# EAGLE design embedded (EAGLE 9.5.2)
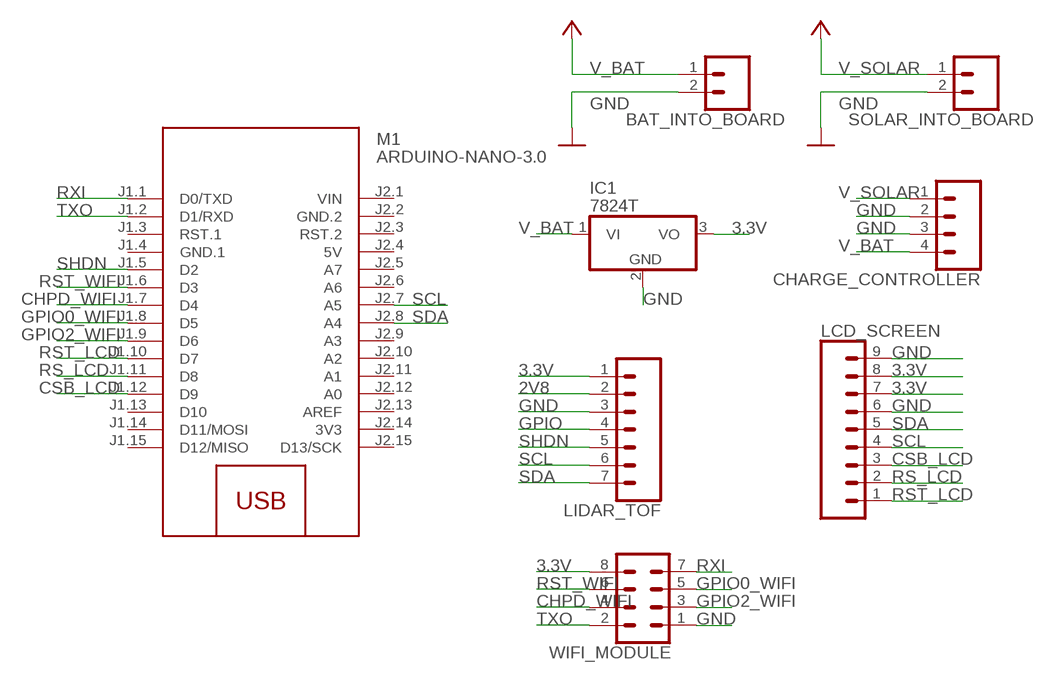
[diagram p0: schematic, sheet 1]

## Parts
BAT_INTO_BOARD  CONN_02  [1X02]
CHARGE_CONTROLLER  CONN_04  [1X04]
IC1  7824T  [TO220H]
LCD_SCREEN  CONN_09  [1X09]
LIDAR_TOF  CONN_07  [1X07]
M1  ARDUINO-NANO-3.0  [ARDUINO-NANO-3.0]
SOLAR_INTO_BOARD  CONN_02  [1X02]
WIFI_MODULE  CONN_04X2  [2X4]

## Nets
2V8: LIDAR_TOF.2
3.3V: IC1.3(VO) LCD_SCREEN.7 LCD_SCREEN.8 LIDAR_TOF.1 WIFI_MODULE.8
CHPD_WIFI: M1.J1.7(D4) WIFI_MODULE.4
CSB_LCD: LCD_SCREEN.3 M1.J1.12(D9)
GND: BAT_INTO_BOARD.2 CHARGE_CONTROLLER.2 CHARGE_CONTROLLER.3 IC1.2(GND) LCD_SCREEN.6 LCD_SCREEN.9 LIDAR_TOF.3 SOLAR_INTO_BOARD.2 WIFI_MODULE.1
GPIO: LIDAR_TOF.4
GPIO0_WIFI: M1.J1.8(D5) WIFI_MODULE.5
GPIO2_WIFI: M1.J1.9(D6) WIFI_MODULE.3
RS_LCD: LCD_SCREEN.2 M1.J1.11(D8)
RST_LCD: LCD_SCREEN.1 M1.J1.10(D7)
RST_WIFI: M1.J1.6(D3) WIFI_MODULE.6
RXI: M1.J1.1(D0/TXD) WIFI_MODULE.7
SCL: LCD_SCREEN.4 LIDAR_TOF.6 M1.J2.7(A5)
SDA: LCD_SCREEN.5 LIDAR_TOF.7 M1.J2.8(A4)
SHDN: LIDAR_TOF.5 M1.J1.5(D2)
TXO: M1.J1.2(D1/RXD) WIFI_MODULE.2
V_BAT: BAT_INTO_BOARD.1 CHARGE_CONTROLLER.4 IC1.1(VI) ; supply symbol labelled VCC
V_SOLAR: CHARGE_CONTROLLER.1 SOLAR_INTO_BOARD.1 ; supply symbol labelled VCC
Unconnected: M1.J1.3(RST.1) M1.J1.13(D10) M1.J1.14(D11/MOSI) M1.J1.15(D12/MISO) M1.J2.3(RST.2) M1.J2.5(A7) M1.J2.6(A6) M1.J2.9(A3) M1.J2.10(A2) M1.J2.11(A1) M1.J2.12(A0) M1.J2.13(AREF) M1.J2.15(D13/SCK)

## Power pins joined to a net without a drawn wire
3V3: M1.J2.14(3V3)
5V: M1.J2.4(5V)
GND.1: M1.J1.4(GND.1)
GND.2: M1.J2.2(GND.2)
VIN: M1.J2.1(VIN)

## Library data of the parts
BAT_INTO_BOARD SOLAR_INTO_BOARD = SparkFun-Connectors:CONN_02: Multi connection point. Often used as Generic Header-pin footprint for 0.1 inch spaced/style header connections On any of the 0.1 inch spaced packages, you can populate with these: Break Away Headers - Straight <https://www.sparkfun.com/products/116> (PRT-00116) Break Away Male Headers - Right Angle <https://www.sparkfun.com/products/553> (PRT-00553) Female Headers <https://www.sparkfun.com/products/115> (PRT-00115) Break Away Headers - Machine Pin <https://www.sparkfun.com/products/117> (PRT-00117) Break Away Female Headers - Swiss Machine Pin <https://www.sparkfun.com/products/743> (PRT-00743) For SCREWTERMINALS and SPRING TERMINALS visit here: Screw Terimnals on SparkFun.com <https://www.sparkfun.com/search/results?term=Screw+Terminals> (5mm/3.5mm/2.54mm spacing) This device is also useful as a general connection point to wire up your design to another part of your project. Our various solder wires solder well into these plated through hole pads. Hook-Up Wire - Assortment (Stranded, 22 AWG) <https://www.sparkfun.com/products/11375> (PRT-11375) Hook-Up Wire - Assortment (Solid Core, 22 AWG) <https://www.sparkfun.com/products/11367> (PRT-11367) View the entire wire category on our website here <https://www.sparkfun.com/categories/141> Special notes: Molex polarized connector foot print use with: PRT-08233 with associated crimp pins and housings. 2.54_SCREWTERM for use with PRT-10571. 3.5mm Screw Terminal footprints for PRT-08084 5mm Screw Terminal footprints for use with PRT-08432
CHARGE_CONTROLLER = SparkFun-Connectors:CONN_04: Multi connection point. Often used as Generic Header-pin footprint for 0.1 inch spaced/style header connections On any of the 0.1 inch spaced packages, you can populate with these: Break Away Headers - Straight <https://www.sparkfun.com/products/116> (PRT-00116) Break Away Male Headers - Right Angle <https://www.sparkfun.com/products/553> (PRT-00553) Female Headers <https://www.sparkfun.com/products/115> (PRT-00115) Break Away Headers - Machine Pin <https://www.sparkfun.com/products/117> (PRT-00117) Break Away Female Headers - Swiss Machine Pin <https://www.sparkfun.com/products/743> (PRT-00743) For SCREWTERMINALS and SPRING TERMINALS visit here: Screw Terimnals on SparkFun.com <https://www.sparkfun.com/search/results?term=Screw+Terminals> (5mm/3.5mm/2.54mm spacing) This device is also useful as a general connection point to wire up your design to another part of your project. Our various solder wires solder well into these plated through hole pads. Hook-Up Wire - Assortment (Stranded, 22 AWG) <https://www.sparkfun.com/products/11375> (PRT-11375) Hook-Up Wire - Assortment (Solid Core, 22 AWG) <https://www.sparkfun.com/products/11367> (PRT-11367) View the entire wire category on our website here <https://www.sparkfun.com/categories/141> Special notes: Molex polarized connector foot print use with SKU : PRT-08231 with associated crimp pins and housings. 1MM SMD Version SKU: PRT-10208; PROD_ID: CONN-09696
IC1 = adafruit:78*: Positive VOLTAGE REGULATOR Added bigger pads to the TO-92 package
LCD_SCREEN = SparkFun-Connectors:CONN_09: Multi connection point. Often used as Generic Header-pin footprint for 0.1 inch spaced/style header connections On any of the 0.1 inch spaced packages, you can populate with these: Break Away Headers - Straight <https://www.sparkfun.com/products/116> (PRT-00116) Break Away Male Headers - Right Angle <https://www.sparkfun.com/products/553> (PRT-00553) Female Headers <https://www.sparkfun.com/products/115> (PRT-00115) Break Away Headers - Machine Pin <https://www.sparkfun.com/products/117> (PRT-00117) Break Away Female Headers - Swiss Machine Pin <https://www.sparkfun.com/products/743> (PRT-00743) For SCREWTERMINALS and SPRING TERMINALS visit here: Screw Terimnals on SparkFun.com <https://www.sparkfun.com/search/results?term=Screw+Terminals> (5mm/3.5mm/2.54mm spacing) This device is also useful as a general connection point to wire up your design to another part of your project. Our various solder wires solder well into these plated through hole pads. Hook-Up Wire - Assortment (Stranded, 22 AWG) <https://www.sparkfun.com/products/11375> (PRT-11375) Hook-Up Wire - Assortment (Solid Core, 22 AWG) <https://www.sparkfun.com/products/11367> (PRT-11367) View the entire wire category on our website here <https://www.sparkfun.com/categories/141> Special notes: Molex polarized connector foot print use with SKU : PRT-08231 with associated crimp pins and housings. 1MM SMD Version SKU: PRT-10208 NOTES ON THE VARIANTS LOCK and LOCK_LONGPADS... This footprint was designed to help hold the alignment of a through-hole component (i.e. 6-pin header) while soldering it into place. You may notice that each hole has been shifted either up or down by 0.005 of an inch from it's more standard position (which is a perfectly straight line). This slight alteration caused the pins (the squares in the middle) to touch the edges of the holes. Because they are alternating, it causes a "brace" to hold the component in place. 0.005 has proven to be the perfect amount of "off-center" position when using our standard breakaway headers. Although looks a little odd when you look at the bare footprint, once you have a header in there, the alteration is very hard to notice. Also,if you push a header all the way into place, it is covered up entirely on the bottom side.
LIDAR_TOF = SparkFun-Connectors:CONN_07: Multi connection point. Often used as Generic Header-pin footprint for 0.1 inch spaced/style header connections On any of the 0.1 inch spaced packages, you can populate with these: Break Away Headers - Straight <https://www.sparkfun.com/products/116> (PRT-00116) Break Away Male Headers - Right Angle <https://www.sparkfun.com/products/553> (PRT-00553) Female Headers <https://www.sparkfun.com/products/115> (PRT-00115) Break Away Headers - Machine Pin <https://www.sparkfun.com/products/117> (PRT-00117) Break Away Female Headers - Swiss Machine Pin <https://www.sparkfun.com/products/743> (PRT-00743) For SCREWTERMINALS and SPRING TERMINALS visit here: Screw Terimnals on SparkFun.com <https://www.sparkfun.com/search/results?term=Screw+Terminals> (5mm/3.5mm/2.54mm spacing) This device is also useful as a general connection point to wire up your design to another part of your project. Our various solder wires solder well into these plated through hole pads. Hook-Up Wire - Assortment (Stranded, 22 AWG) <https://www.sparkfun.com/products/11375> (PRT-11375) Hook-Up Wire - Assortment (Solid Core, 22 AWG) <https://www.sparkfun.com/products/11367> (PRT-11367) View the entire wire category on our website here <https://www.sparkfun.com/categories/141> Special notes: Molex polarized connector foot print use with SKU : PRT-08231 with associated crimp pins and housings. 1MM SMD Version SKU: PRT-10208 NOTES ON THE VARIANTS LOCK and LOCK_LONGPADS... This footprint was designed to help hold the alignment of a through-hole component (i.e. 6-pin header) while soldering it into place. You may notice that each hole has been shifted either up or down by 0.005 of an inch from it's more standard position (which is a perfectly straight line). This slight alteration caused the pins (the squares in the middle) to touch the edges of the holes. Because they are alternating, it causes a "brace" to hold the component in place. 0.005 has proven to be the perfect amount of "off-center" position when using our standard breakaway headers. Although looks a little odd when you look at the bare footprint, once you have a header in there, the alteration is very hard to notice. Also,if you push a header all the way into place, it is covered up entirely on the bottom side.
M1 = diy-modules:ARDUINO-NANO-3.0: Arduino Nano 3.0
WIFI_MODULE = SparkFun-Connectors:CONN_04X2: Multi connection point. Often used as Generic Header-pin footprint for 0.1 inch spaced/style header connections On any of the 0.1 inch spaced packages, you can populate with these: Break Away Headers - Straight <https://www.sparkfun.com/products/116> (PRT-00116) Break Away Male Headers - Right Angle <https://www.sparkfun.com/products/553> (PRT-00553) Female Headers <https://www.sparkfun.com/products/115> (PRT-00115) Break Away Headers - Machine Pin <https://www.sparkfun.com/products/117> (PRT-00117) Break Away Female Headers - Swiss Machine Pin <https://www.sparkfun.com/products/743> (PRT-00743)

## Board
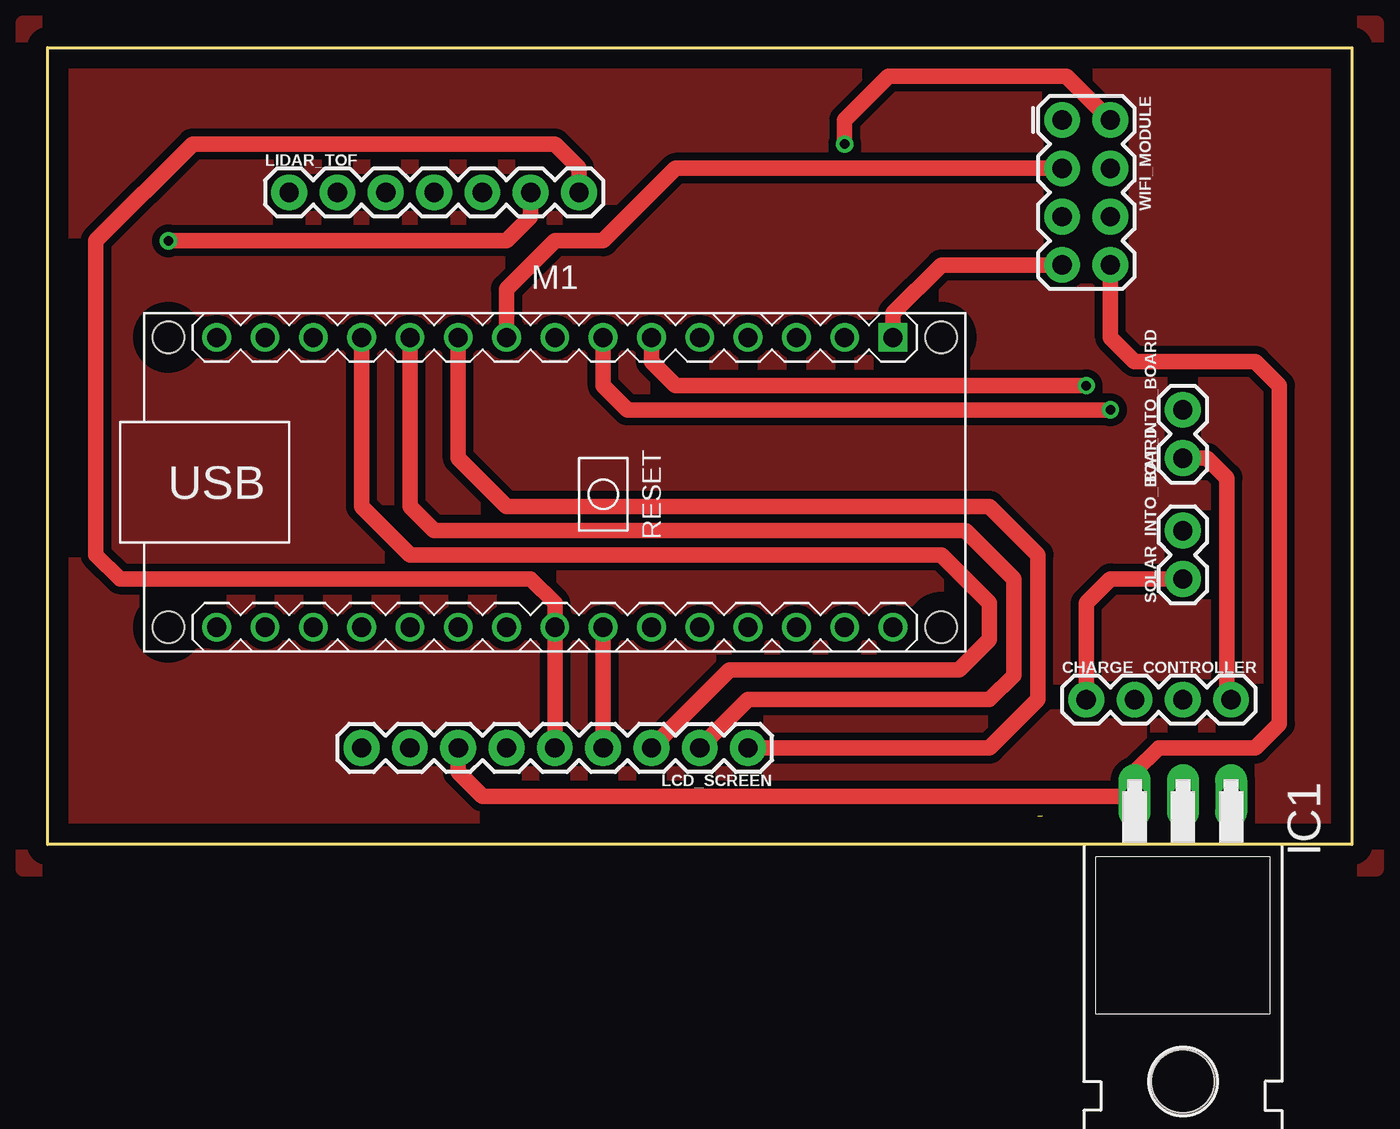
[diagram p1: board, top side]
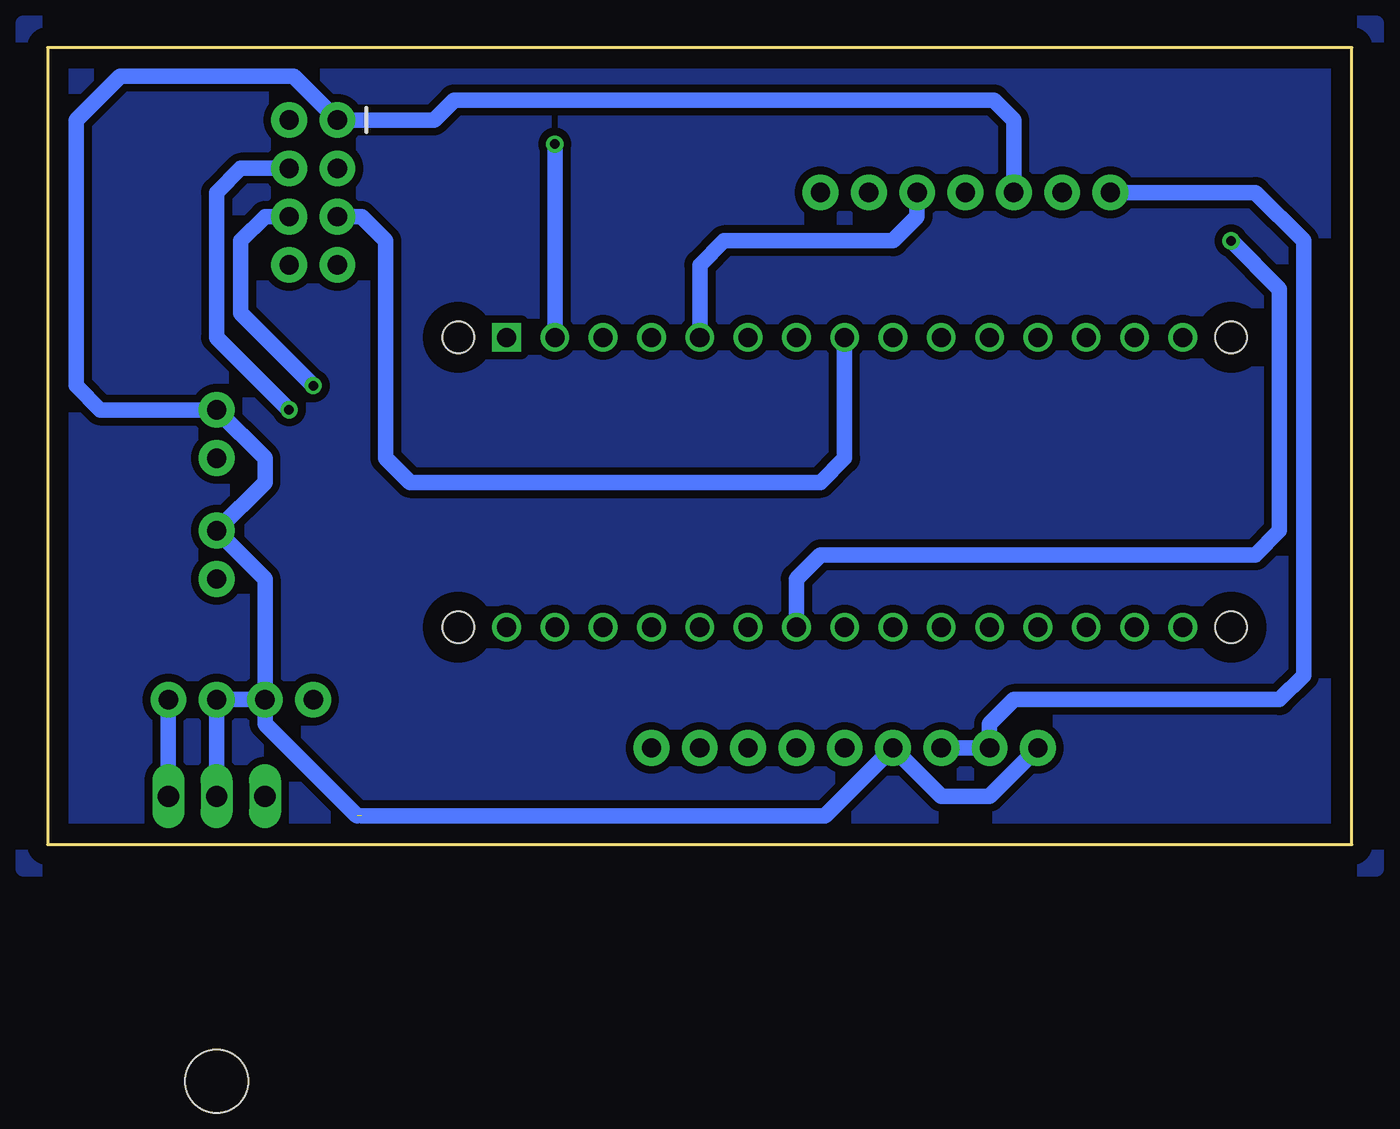
[diagram p2: board, bottom side, seen from below]

Size 68.58 x 41.91 mm. Coordinates in mm from the lower left corner, seen from the top.
Outline: 0,0 0,41.91 68.58,41.91 68.58,0 0,0
Copper layers (1*16): Top 0.035mm / dielectric 1.5mm / Bottom 0.035mm
Design rules "default": minimum track width 6mil, minimum drill 0.35mm, track to track 6mil, track to pad 6mil, pad to pad 6mil, via to via 6mil, smd to smd 6mil, copper to edge 40mil, drill to drill 6mil, minimum pad ring 10mil, minimum via ring 8mil, stop-mask expansion 4mil, vias tented up to drill 0mil, thermal gap 10mil

### Footprints (pad centres in the part's own frame; a part is rotated, then mirrored left to right if it is on the bottom)
1X02 = drill 1.016 pad 1.88: 1 0,0; 2 2.54,0
1X04 = drill 1.016 pad 1.88: 1 0,0; 2 2.54,0; 3 5.08,0; 4 7.62,0
TO220H = drill 1.118 long: 1 -2.54,-10.16; 2 0,-10.16; 3 2.54,-10.16 | hole 3.302: 0,4.826
1X09 = drill 1.016 pad 1.88: 1 0,0; 2 2.54,0; 3 5.08,0; 4 7.62,0; 5 10.16,0; 6 12.7,0; 7 15.24,0; 8 17.78,0; 9 20.32,0
1X07 = drill 1.016 pad 1.88: 1 0,0; 2 2.54,0; 3 5.08,0; 4 7.62,0; 5 10.16,0; 6 12.7,0; 7 15.24,0
ARDUINO-NANO-3.0 = drill 1 square: J1.1 17.78,7.62 | drill 1: J1.2 15.24,7.62; J1.3 12.7,7.62; J1.4 10.16,7.62; J1.5 7.62,7.62; J1.6 5.08,7.62; J1.7 2.54,7.62; J1.8 0,7.62; J1.9 -2.54,7.62; J1.10 -5.08,7.62; J1.11 -7.62,7.62; J1.12 -10.16,7.62; J1.13 -12.7,7.62; J1.14 -15.24,7.62; J1.15 -17.78,7.62; J2.1 17.78,-7.62; J2.2 15.24,-7.62; J2.3 12.7,-7.62; J2.4 10.16,-7.62; J2.5 7.62,-7.62; J2.6 5.08,-7.62; J2.7 2.54,-7.62; J2.8 0,-7.62; J2.9 -2.54,-7.62; J2.10 -5.08,-7.62; J2.11 -7.62,-7.62; J2.12 -10.16,-7.62; J2.13 -12.7,-7.62; J2.14 -15.24,-7.62; J2.15 -17.78,-7.62 | hole 1.651: -20.32,7.62; -20.32,-7.62; 20.32,-7.62; 20.32,7.62
2X4 = drill 1.016 pad 1.88: 1 -3.81,-1.27; 2 -3.81,1.27; 3 -1.27,-1.27; 4 -1.27,1.27; 5 1.27,-1.27; 6 1.27,1.27; 7 3.81,-1.27; 8 3.81,1.27

### Placement (x,y rotation side)
BAT_INTO_BOARD  59.69,20.32 90 top
CHARGE_CONTROLLER  54.61,7.62 0 top
IC1  59.69,-7.62 180 top
LCD_SCREEN  36.83,5.08 180 top
LIDAR_TOF  12.7,34.29 0 top
M1  26.67,19.05 0 top
SOLAR_INTO_BOARD  59.69,13.97 90 top
WIFI_MODULE  54.61,34.29 270 top

### Tracks (layer width: path | path; a pad name or v marks a point on that pad's centre or on a via)
3.3V
  Top 0.813: WIFI_MODULE.8 55.88,26.67 57.15,25.4 63.5,25.4 64.77,24.13 64.77,6.35 63.5,5.08 58.42,5.08 57.15,3.81 IC1.3 22.86,2.54 21.59,3.81 LCD_SCREEN.7
  Bottom 0.813: LIDAR_TOF.1 5.08,34.29 2.54,31.75 2.54,8.89 3.81,7.62 17.78,7.62 19.05,6.35 LCD_SCREEN.8 LCD_SCREEN.7
CHPD_WIFI  (via drill 0.5)
  Top 0.813: v55.88,22.86 30.48,22.86 29.21,24.13 M1.J1.7
  Bottom 0.813: WIFI_MODULE.4 58.42,35.56 59.69,34.29 59.69,26.67 v55.88,22.86
CSB_LCD
  Top 0.813: M1.J1.12 16.51,17.78 19.05,15.24 46.99,15.24 49.53,12.7 49.53,10.79 47.92,9.18 35.85,9.18 LCD_SCREEN.3
GND  (1 unrouted)
  Bottom 0.813: CHARGE_CONTROLLER.2 CHARGE_CONTROLLER.3 IC1.2 | BAT_INTO_BOARD.2 57.15,20.32 57.15,19.05 SOLAR_INTO_BOARD.2 57.15,13.97 CHARGE_CONTROLLER.2 | 52.3,1.5 57.15,6.35 CHARGE_CONTROLLER.2 | 52.07,1.5 27.71,1.5 LCD_SCREEN.6 21.59,2.54 19.05,2.54 LCD_SCREEN.9 | BAT_INTO_BOARD.2 58.42,21.59 | BAT_INTO_BOARD.2 65.81,22.86 67.08,24.13 67.08,38.1 64.77,40.41 55.65,40.41 WIFI_MODULE.1 48.26,38.1 47.22,39.14 18.82,39.14 17.78,38.1 LIDAR_TOF.3
GPIO0_WIFI
  Bottom 0.813: WIFI_MODULE.5 52.07,33.02 50.8,31.75 50.8,20.32 49.53,19.05 27.94,19.05 26.67,20.32 M1.J1.8
GPIO2_WIFI
  Top 0.813: WIFI_MODULE.3 33.02,35.56 29.21,31.75 26.67,31.75 24.13,29.21 M1.J1.9
N$1
  pour Top (isolate 0.406): -1.27,43.18 69.85,43.18 69.85,-1.27 -1.27,-1.27
N$2
  pour Bottom (isolate 0.406): -1.27,43.18 69.85,43.18 69.85,-1.27 -1.27,-1.27
RS_LCD
  Top 0.813: LCD_SCREEN.2 36.83,7.62 49.53,7.62 50.8,8.89 50.8,13.97 48.26,16.51 20.32,16.51 19.05,17.78 M1.J1.11
RST_LCD
  Top 0.813: LCD_SCREEN.1 49.53,5.08 52.07,7.62 52.07,15.24 49.53,17.78 24.13,17.78 21.59,20.32 M1.J1.10
RST_WIFI  (via drill 0.5)
  Top 0.813: v54.61,24.13 33.02,24.13 31.75,25.4 M1.J1.6
  Bottom 0.813: WIFI_MODULE.6 57.15,33.02 58.42,31.75 58.42,27.94 v54.61,24.13
RXI
  Top 0.813: WIFI_MODULE.7 46.99,30.48 44.45,27.94 M1.J1.1
SCL  (via drill 0.5)
  Top 0.813: M1.J2.7 LCD_SCREEN.4 | LIDAR_TOF.6 25.4,33.02 24.13,31.75 v6.35,31.75
  Bottom 0.813: v6.35,31.75 3.81,29.21 3.81,16.51 5.08,15.24 27.94,15.24 29.21,13.97 M1.J2.7
SDA
  Top 0.813: LCD_SCREEN.5 M1.J2.8 26.67,12.7 25.4,13.97 3.81,13.97 2.54,15.24 2.54,31.75 7.62,36.83 26.67,36.83 27.94,35.56 LIDAR_TOF.7
SHDN
  Bottom 0.813: LIDAR_TOF.5 22.86,33.02 24.13,31.75 33.02,31.75 34.29,30.48 M1.J1.5
TXO  (via drill 0.5)
  Top 0.813: WIFI_MODULE.2 53.57,40.41 44.22,40.41 41.91,38.1 v41.91,36.83
  Bottom 0.813: v41.91,36.83 M1.J1.2
V_BAT
  Top 0.813: CHARGE_CONTROLLER.4 62,7.85 62,19.28 60.96,20.32 BAT_INTO_BOARD.1
  Bottom 0.813: IC1.1 CHARGE_CONTROLLER.4
V_SOLAR
  Top 0.813: CHARGE_CONTROLLER.1 54.61,12.7 55.88,13.97 SOLAR_INTO_BOARD.1